# EAGLE design 555 ping pong balls - alt (EAGLE 5.06)
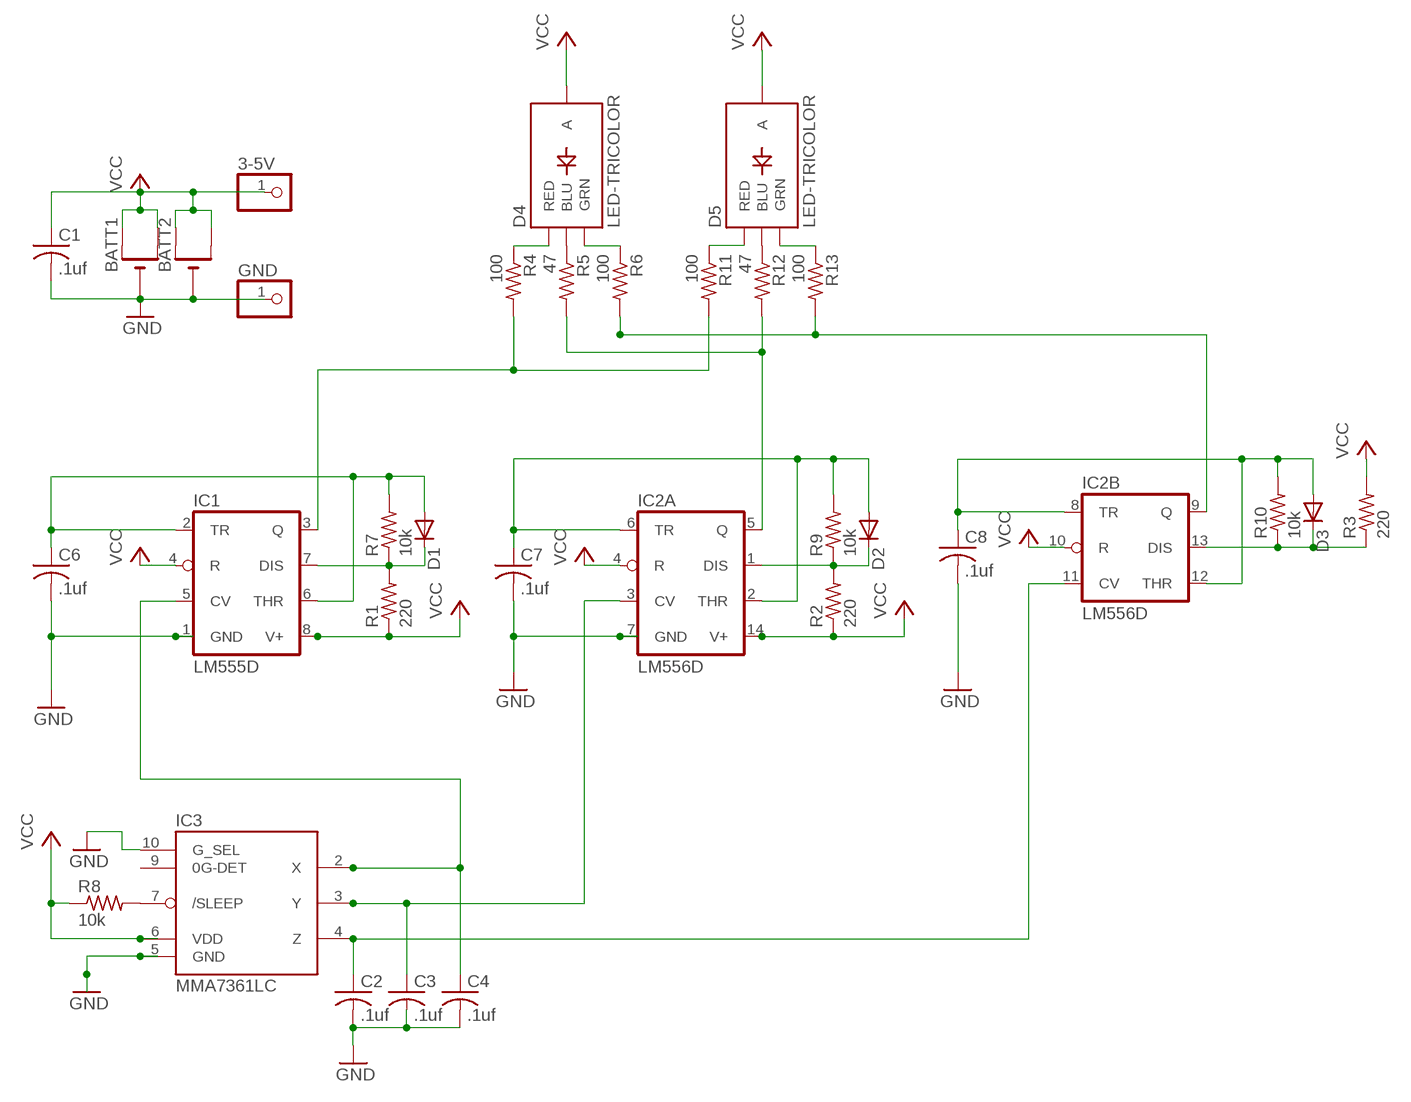
[diagram p0: schematic, sheet 1]

## Parts
3-5V  PINHD-1X1  [1X01]
BATT1  CR2032  [CR2032-SMD]
BATT2  CR2032  [CR2032-SMD]
C1  .1uf  C-USC0603  [C0603]
C2  .1uf  C-USC0603  [C0603]
C3  .1uf  C-USC0603  [C0603]
C4  .1uf  C-USC0603  [C0603]
C6  .1uf  C-USC0603  [C0603]
C7  .1uf  C-USC0603  [C0603]
C8  .1uf  C-USC0603  [C0603]
D1  DIODE-SOD110-R  [SOD110-R]
D2  DIODE-SOD110-R  [SOD110-R]
D3  DIODE-SOD110-R  [SOD110-R]
D4  LED-TRICOLOR  LED-TRICOLORTH  [LED-TRICOLOR-THROUGHHOLE]
D5  LED-TRICOLOR  LED-TRICOLORTH  [LED-TRICOLOR-THROUGHHOLE]
GND  PINHD-1X1  [1X01]
IC1  LM555D  [SO08]
IC2  LM556D  [SO14]
IC3  MMA7361LC  MMA7260/MMA7261LGA14  [LGA14]
R1  220  R-US_R0603  [R0603]
R2  220  R-US_R0603  [R0603]
R3  220  R-US_R0603  [R0603]
R4  100  R-US_R0603  [R0603]
R5  47  R-US_R0603  [R0603]
R6  100  R-US_R0603  [R0603]
R7  10k  R-US_R0603  [R0603]
R8  10k  R-US_R0603  [R0603]
R9  10k  R-US_R0603  [R0603]
R10  10k  R-US_R0603  [R0603]
R11  100  R-US_R0603  [R0603]
R12  47  R-US_R0603  [R0603]
R13  100  R-US_R0603  [R0603]

## Nets
N$1: D4.GRN R6.1
N$2: C2.1 IC2.11(B:CV) IC3.4(Z)
N$3: C3.1 IC2.3(A:CV) IC3.3(Y)
N$4: D1.C IC1.7(DIS) R1.2 R7.1
N$5: C6.1 D1.A IC1.2(TR) IC1.6(THR) R7.2
N$6: C7.1 D2.A IC2.2(A:THR) IC2.6(A:TR) R9.2
N$7: C8.1 D3.A IC2.8(B:TR) IC2.12(B:THR) R10.2
N$8: C4.1 IC1.5(CV) IC3.2(X)
N$9: D3.C IC2.13(B:DIS) R3.1 R10.1
N$10: D4.BLU R5.1
N$11: D5.BLU R12.1
N$12: D4.RED R4.1
N$14: IC2.5(A:Q) R5.2 R12.2
N$16: IC3.7(/SLEEP) R8.2
N$17: D2.C IC2.1(A:DIS) R2.2 R9.1
N$18: D5.GRN R13.1
N$19: D5.RED R11.1
N$20: BATT1.- BATT2.- C1.2 C2.2 C3.2 C4.2 C6.2 C7.2 C8.2 GND.1 IC1.1(GND) IC2.7(A:GND) IC3.5(GND) IC3.10(G_SEL) ; supply symbol labelled GND
N$21: IC2.9(B:Q) R6.2 R13.2
N$22: IC1.3(Q) R4.2 R11.2
N$31: 3-5V.1 BATT1.+$1(+) BATT1.+$2(+1) BATT2.+$1(+) BATT2.+$2(+1) C1.1 D4.COMMON(A) D5.COMMON(A) IC1.4(R) IC1.8(V+) IC2.4(A:R) IC2.10(B:R) IC2.14(A:V+) IC3.6(VDD) R1.1 R2.1 R3.2 R8.1 ; supply symbol labelled VCC
Unconnected: IC3.9(0G-DET)

## Library data of the parts
3-5V GND = digg:PINHD-1X1: PIN HEADER
BATT1 BATT2 = digg:CR2032
C1-C4 C6-C8 = rcl:C-US: CAPACITOR, American symbol
D1-D3 = diode:DIODE-: DIODE
D4 D5 = SYNShop:LED-TRICOLOR: Tri-Color LED SMD Proven layout and schematic for triple color LED in SMD package - common anode. Spark Fun Electronics SKU : COM-07844
IC1 = linear:*555: TIMER
IC2 = linear:*556: Dual TIMER
IC3 = mma7260_7261:MMA7260/MMA7261
R1-R13 = rcl:R-US_: RESISTOR, American symbol

## Board
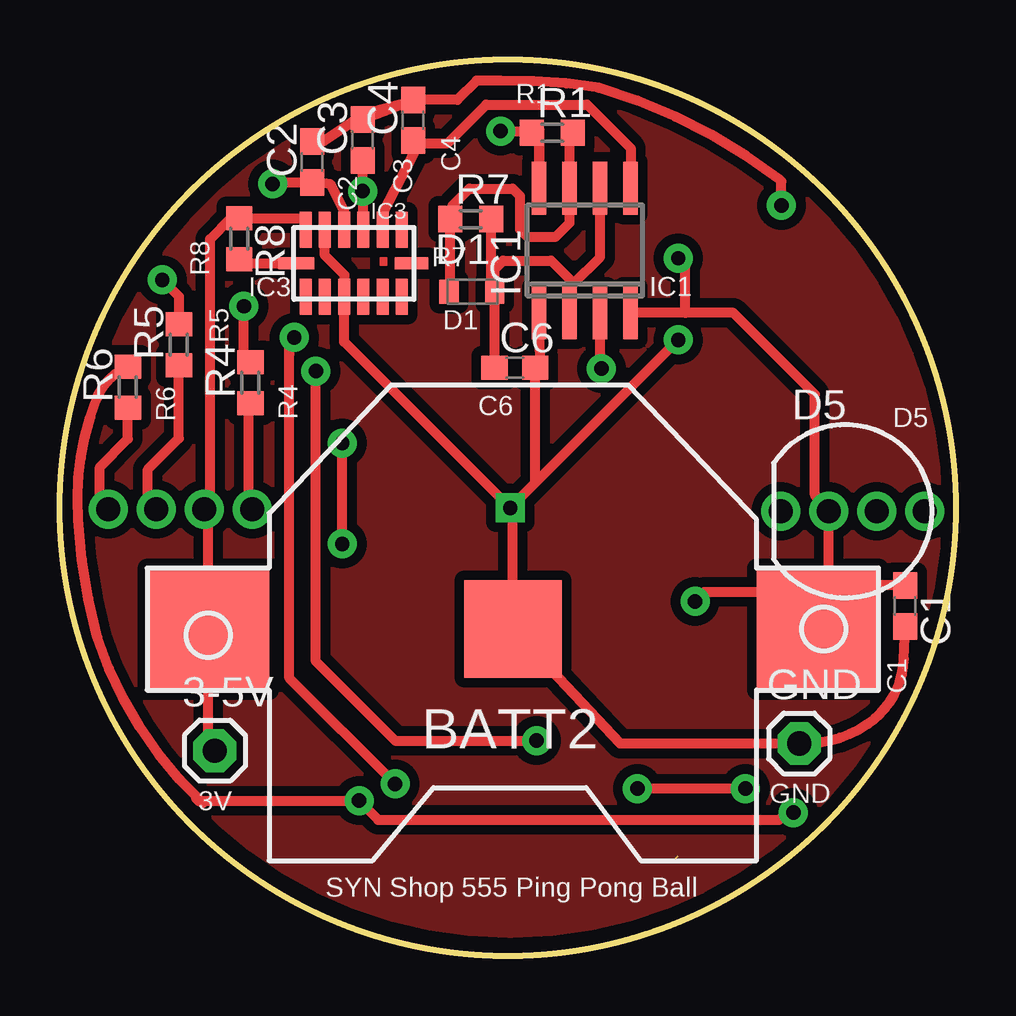
[diagram p1: board, top side]
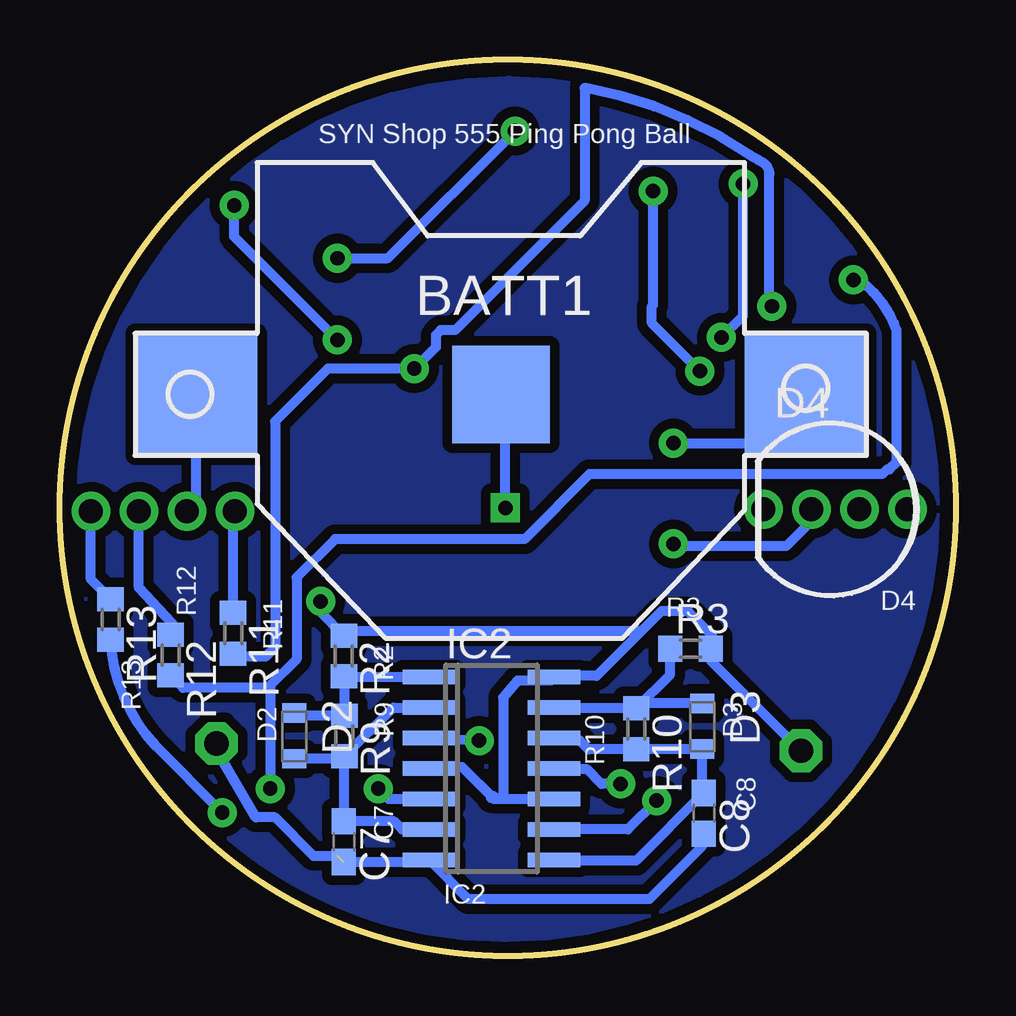
[diagram p2: board, bottom side, seen from below]

Size 37.32 x 37.32 mm. Coordinates in mm from the lower left corner, seen from the top.
Outline: circle at 18.66,18.66 radius 18.66
Copper layers (1*16): Top 0.0356mm / dielectric 1.5011mm / Bottom 0.0356mm
Design rules "LaenPCBOrder *": minimum track width 6mil, minimum drill 13mil, track to track 6mil, track to pad 6mil, pad to pad 6mil, via to via 6mil, smd to smd 6mil, copper to edge 15mil, drill to drill 6mil, minimum pad ring 12mil, minimum via ring 12mil, stop-mask expansion 4mil, vias tented up to drill 0mil, thermal gap 10mil

### Footprints (pad centres in the part's own frame; a part is rotated, then mirrored left to right if it is on the bottom)
1X01 = drill 1.016 pad 1.778 octagon: 1 0,0
CR2032-SMD = smd 5.08 x 5.08: +$1 -12.7,0; +$2 12.7,0 | smd 4.064 x 4.064: - 0,0
C0603 = smd 1.1 x 1: 1 -0.85,0; 2 0.85,0
SOD110-R = smd 0.8 x 1: A 0.95,0; C -0.95,0
LED-TRICOLOR-THROUGHHOLE = drill 1 round: BLU 1,0; COMMON -1,0; GRN 3,0; RED -3,0
SO08 = smd 0.6 x 2.2: 1 -1.905,-2.6; 2 -0.635,-2.6; 3 0.635,-2.6; 4 1.905,-2.6; 5 1.905,2.6; 6 0.635,2.6; 7 -0.635,2.6; 8 -1.905,2.6
SO14 = smd 0.6 x 2.2: 1 -3.81,-2.6; 2 -2.54,-2.6; 3 -1.27,-2.6; 4 0,-2.6; 5 1.27,-2.6; 6 2.54,-2.6; 7 3.81,-2.6; 8 3.81,2.6; 9 2.54,2.6; 10 1.27,2.6; 11 0,2.6; 12 -1.27,2.6; 13 -2.54,2.6; 14 -3.81,2.6
LGA14 = smd 1.5 x 0.5: 1 1.4,-2; 2 1.4,-1.2; 3 1.4,-0.4; 4 1.4,0.4; 5 1.4,1.2; 6 1.4,2; 8 -1.4,2; 9 -1.4,1.2; 10 -1.4,0.4; 11 -1.4,-0.4; 12 -1.4,-1.2; 13 -1.4,-2 | smd 0.5 x 1.5: 7 0,2.4 | smd 0.5 x 1.4: 14 0,-2.4
R0603 = smd 1 x 1.1: 1 -0.85,0; 2 0.85,0

### Placement (x,y rotation side)
3-5V  6.45,8.54 0 top
BATT1  18.95,23.39 0 bottom
BATT2  18.87,13.61 180 top
C1  35.21,14.57 270 top
C2  10.51,33.07 90 top
C3  12.61,33.99 90 top
C4  14.71,34.81 90 top
C6  18.95,24.49 0 top
C7  25.49,4.75 270 bottom
C8  10.49,5.93 270 bottom
D1  17.16,27.66 0 top
D2  27.56,9.16 270 bottom
D3  10.56,9.56 270 bottom
D4  5.01,18.6 0 bottom
D5  33.03,18.52 0 top
GND  30.8,8.84 0 top
IC1  21.87,29.38 0 top
IC2  19.34,7.8 270 bottom
IC3  12.24,28.85 90 top
R1  20.51,34.29 0 top
R2  25.49,12.49 270 bottom
R3  11.05,12.79 0 bottom
R4  7.93,23.87 90 top
R5  4.95,25.46 90 top
R6  2.83,23.69 90 top
R7  17.11,30.69 0 top
R8  7.47,29.87 270 top
R9  25.47,9.15 270 bottom
R10  13.31,9.45 270 bottom
R11  30.11,13.43 270 bottom
R12  32.71,12.53 270 bottom
R13  35.21,14.01 270 bottom

### Tracks (layer width: path | path; a pad name or v marks a point on that pad's centre or on a via)
N$1
  Top 0.406: R6.1 2.83,21.53 1.66,20.36 1.66,18.85 D4.GRN
N$2  (via drill 0.6)
  Top 0.406: IC3.4 11.84,30.98 11.26,32.16 10.57,32.26 C2.1 8.92,32.22 v8.86,32.16 | v13.96,7.16 9.56,11.56 9.56,25.06 9.56,25.56 v9.76,25.76
  Bottom 0.406: IC2.11 16.7,7.76 15.36,7.76 14.76,7.16 v13.96,7.16 | v9.76,25.76 8.86,26.66 v8.86,32.16
N$3  (via drill 0.6)
  Top 0.406: v12.61,31.86 12.61,30.58 IC3.3 | v12.61,31.86 C3.1 v12.61,31.86 | v19.86,8.96 13.96,8.96 10.66,12.26 v10.66,24.36
  Bottom 0.406: IC2.3 v19.86,8.96 | v10.66,24.36 12.66,26.36 12.66,27.06 12.61,27.11 v12.61,31.86
N$4
  Top 0.406: R1.2 21.24,34.17 IC1.7 21.24,30.54 20.66,29.96 19.46,29.96 19.16,30.26 19.16,31.66 18.86,31.96 17.06,31.96 16.36,31.26 16.36,30.79 R7.1 16.26,27.71 D1.C
N$5
  Top 0.406: R7.2 17.96,27.81 D1.A | D1.A C6.1 | IC1.6 22.51,29.11 21.41,28.01 | 21.41,28.01 21.16,27.76 21.24,27.69 IC1.2 | D1.A 18.11,28.61 18.46,28.96 20.46,28.96 21.41,28.01
N$6
  Bottom 0.406: D2.A 25.56,8.21 R9.2 | R9.2 25.47,5.62 C7.1 23.4,5.6 23.06,5.26 IC2.6 | IC2.2 23.43,10.34 R9.2
N$7
  Bottom 0.406: IC2.12 16.63,8.96 15.66,8.96 15.3,8.6 R10.2 D3.A 10.56,6.85 C8.1 13.31,3.96 16.96,3.96 16.93,3.99 IC2.8
N$8
  Top 0.406: IC3.2 13.44,30.94 14.76,33.46 14.66,33.91 C4.1 14.71,33.86 16.16,33.86 17.76,35.46 21.96,35.46 23.78,33.65 IC1.5
N$9
  Bottom 0.406: D3.C 13.1,10.51 R10.1 | R10.1 16.7,10.3 IC2.13 | R3.1 11.9,11.71 R10.1
N$10
  Top 0.406: R5.1 4.95,21.55 3.66,20.26 3.66,18.85 D4.BLU
N$11
  Bottom 0.406: D5.BLU 34.03,15.33 32.66,13.86 32.66,13.43 R12.1
N$12
  Top 0.406: D4.RED 7.86,18.96 7.86,22.95 7.81,23 R4.1
N$13
  pour Top (isolate 0.406, no thermals): 18.66,36.46 arc90 0.86,18.66 arc90 18.66,0.86 18.86,0.86 arc90 36.66,18.66 arc90 18.86,36.46
N$14  (via drill 0.6)
  Top 0.406: R5.2 4.95,27.47 v4.26,28.16 | v28.56,6.96 v24.06,6.96
  Bottom 0.406: v4.26,28.16 3.96,28.16 3.46,27.66 arc26 2.46,26.06 2.46,20.56 2.76,20.26 2.86,20.26 3.06,20.06 15.26,20.06 17.96,17.36 25.86,17.36 27.46,15.76 27.46,12.36 28.56,11.26 | 28.56,11.26 28.66,11.16 32.19,11.16 R12.2 | IC2.5 23.63,6.53 v24.06,6.96 | 28.56,11.26 v28.56,6.96
N$15
  pour Bottom (isolate 0.406, no thermals): 18.56,36.56 arc90 0.76,18.76 0.76,18.56 arc90 18.66,0.66 18.86,0.66 arc90 36.56,18.36 36.56,18.66 arc90 18.66,36.56
N$16
  Top 0.406: IC3.7 7.6,28.85 R8.2
N$17
  Bottom 0.406: IC2.1 25.46,11.61 R2.2 25.47,11.62 R9.1 27.45,10 D2.C
N$18
  Bottom 0.406: D5.GRN 36.03,15.68 R13.1
N$19
  Bottom 0.406: R11.1 30.11,18.5 D5.RED
N$20  (via drill 0.6)  (1 unrouted)
  Top 0.254: C4.2 14.9,35.22
  Top 0.406: v30.06,31.26 30.06,32.26 arc-5 29.96,32.36 arc21 22.46,36.16 arc11 18.36,36.46 17.36,36.46 16.56,35.66 C4.2 14.56,35.56 | C1.2 35.16,12.36 arc-54 33.66,9.66 arc-36 GND.1 23.34,8.84 BATT2.- 18.87,18.65 v18.76,18.66 | IC1.1 20,24.62 C6.2 19.8,19.7 19.76,19.66 | 14.56,35.56 14.53,35.56 C3.2 12.59,35.06 12.66,35.06 | C2.2 10.92,33.92 12.66,35.06 | IC3.5 11.04,29.18 11.86,28.36 11.86,27.93 IC3.10 11.84,25.58 v18.76,18.66 | v18.76,18.66 19.76,19.66 | 14.56,35.56 12.66,35.06 | 19.76,19.66 v25.76,25.66
  Bottom 0.406: v25.76,25.66 30.06,29.96 v30.06,31.26 | v18.76,18.66 18.76,23.38 BATT1.- | C7.2 22.03,3.9 IC2.7 20.31,2.36 12.76,2.36 10.56,4.56 10.56,5.16 C8.2 | 25.76,4.16 26.76,4.16 28.36,5.76 29.16,5.76 30.56,8.16 30.8,8.56 GND.1
N$21  (via drill 0.6)
  Top 0.406: 5.76,6.46 5.96,6.36 arc-29 1.56,13.26 arc-12 0.76,18.16 arc-26 1.56,23.26 arc-46 R6.2 | 5.76,6.46 5.66,6.56 | 5.76,6.46 v12.46,6.46 13.26,5.66 29.96,5.66 30.26,5.96 v30.56,5.96
  Bottom 0.406: IC2.9 13.66,5.26 v12.46,6.46 | v30.56,5.96 33.36,8.76 arc39 R13.2
N$22  (via drill 0.6)
  Top 0.406: v22.56,24.46 22.51,24.52 IC1.3 | R4.2 7.66,24.89 v7.66,27.06
  Bottom 0.406: R11.2 29.99,12.46 28.76,12.46 28.36,12.86 28.36,22.26 26.16,24.46 v22.56,24.46 21.66,25.36 21.66,25.86 21.46,26.06 20.86,26.06 15.46,31.46 15.46,36.16 arc24 8.56,33.36 arc-6 8.06,33.06 arc62 7.76,32.56 7.76,27.16 v7.66,27.06
N$23
  pour Bottom (isolate 0.406, no thermals): 10.06,10.56 10.06,8.86 15.66,8.86 15.66,10.56
N$31  (via drill 0.6)
  Top 0.406: 32.03,14.99 D5.COMMON 31.45,19.2 31.45,23.39 28.06,26.78 26.06,26.78 | 32.03,14.99 32.16,14.06 | C1.1 35.17,15.46 32.26,15.46 31.47,14.17 BATT2.+$1 | 3-5V.1 6.17,8.92 BATT2.+$2 6.17,18.54 D4.COMMON 6.26,18.6 6.26,29.86 7.12,30.72 R8.1 10.17,30.72 IC3.6 | R1.1 19.97,33.99 IC1.8 19.96,34.46 19.86,34.36 v18.36,34.36 | 26.06,26.78 IC1.4 | v25.76,29.06 26.06,28.76 26.06,26.78 | v26.46,14.76 26.86,15.16 31.46,15.16 31.47,15.15 BATT2.+$1 | 32.03,14.99 31.47,13.43 BATT2.+$1 | v11.76,17.16 v11.76,21.36
  Bottom 0.406: BATT1.+$1 31.65,18.8 D5.COMMON | 13.11,13.51 12.26,14.36 11.16,14.36 10.16,13.36 10.16,12.83 R3.2 10.2,12.29 3-5V.1 | 13.11,13.51 14.96,11.66 16.36,11.66 16.41,11.61 IC2.14 16.89,11.46 18.26,11.46 18.86,10.76 18.86,6.56 19.36,6.56 19.36,6.66 19.26,6.66 19.26,6.56 20.56,7.86 | 20.56,7.86 21.88,7.86 IC2.4 | IC2.10 19.23,6.53 20.56,7.86 | v18.36,34.36 23.66,29.06 v25.76,29.06 | v26.46,14.76 26.46,14.31 R2.1 25.32,13.51 13.11,13.51 | BATT1.+$2 8.28,21.36 v11.76,21.36 | v11.76,17.16 11.66,17.06 7.06,17.06 5.91,18.21 D4.COMMON

### Text on the board
_tsilk: R1 | C4 | C3 | C2 | R8 | IC3 | R7 | IC1 | R5 | D1 | R6 | R4 | C6 | D5 | C1 | GND | 3V | SYN Shop 555 Ping Pong Ball
_bsilk: SYN Shop 555 Ping Pong Ball | R12 | D4 | R11 | R3 | R2 | R13 | D3 | R9 | D2 | C8 | R10 | C7 | IC2